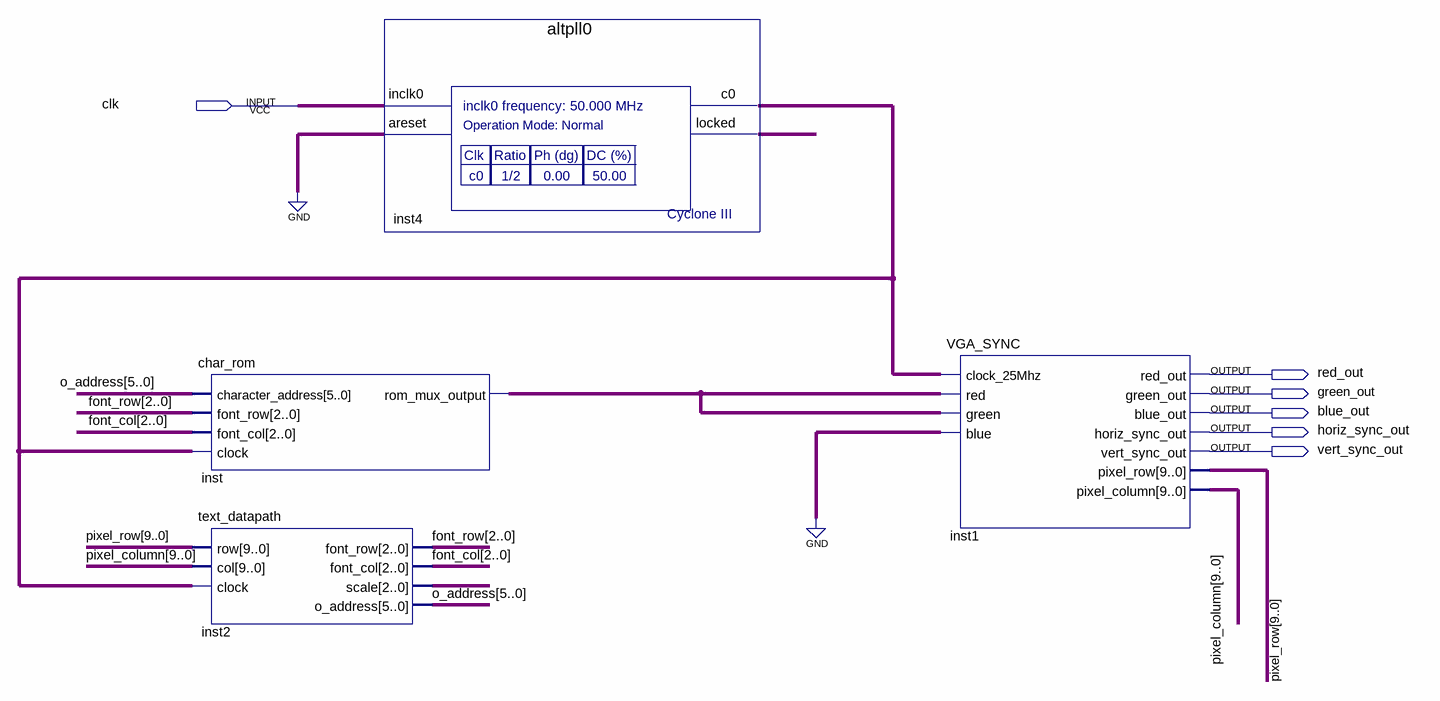
[diagram p0: schematic sheet]
// Quartus schematic BlockRGBTest.bdf as structural Verilog: 4 symbols, 6 pins
module BlockRGBTest (
  input  clk,
  output red_out,
  output green_out,
  output blue_out,
  output horiz_sync_out,
  output vert_sync_out
);

  wire inst4_c0, inst4_locked, inst_rom_mux_output;
  wire [2:0] font_col, font_row, inst2_scale;
  wire [5:0] o_address;
  wire [9:0] pixel_column, pixel_row;

  char_rom inst (
    .character_address(o_address), .font_row(font_row), .font_col(font_col), .clock(inst4_c0),
    .rom_mux_output(inst_rom_mux_output));
  text_datapath inst2 (
    .row(pixel_row), .col(pixel_column), .clock(inst4_c0), .font_row(font_row), .font_col(font_col),
    .scale(inst2_scale), .o_address(o_address));
  altpll0 inst4 (.inclk0(clk), .areset(1'b0), .c0(inst4_c0), .locked(inst4_locked));
  VGA_SYNC inst1 (
    .clock_25Mhz(inst4_c0), .red(inst_rom_mux_output), .green(inst_rom_mux_output), .blue(1'b0),
    .red_out(red_out), .green_out(green_out), .blue_out(blue_out), .horiz_sync_out(horiz_sync_out),
    .vert_sync_out(vert_sync_out), .pixel_row(pixel_row), .pixel_column(pixel_column));
endmodule
